# EAGLE design PlugEVSE_1x32A (EAGLE 8.6.0)
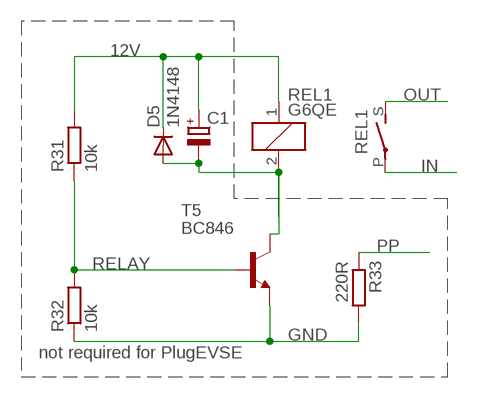
[diagram p0: schematic, sheet 1]

## Parts
C1  CPOL-EUSMCC  [SMC_C]
D5  1N4148  DIODE-SOD123  [SOD123]
R31  10k  R-EU_R0603  [R0603]
R32  10k  R-EU_R0603  [R0603]
R33  220R  R-EU_R2512  [R2512]
REL1  G6QE  [G6QE]
T5  BC846  [SOT23]

## Nets
12V: C1.+ D5.C R31.2 REL1.1
GND: R32.1 R33.2 T5.2(E)
IN: REL1.P
OUT: REL1.S
PP: R33.1
RELAY: R31.1 R32.2 T5.1(B)
RL: C1.- D5.A REL1.2 T5.3(C)

## Notes on the sheet
- not required for PlugEVSE

## Library data of the parts
C1 = rcl:CPOL-EU: POLARIZED CAPACITOR, European symbol; SPICEPREFIX: C
D5 = diode:DIODE-: DIODE
R31 R32 = rcl:R-EU_: RESISTOR, European symbol; SPICEPREFIX: R
R33 = rcl:R-EU_: RESISTOR, European symbol
REL1 = evse:G6QE
T5 = transistor:BC846: NPN TRANSISTOR

## Board
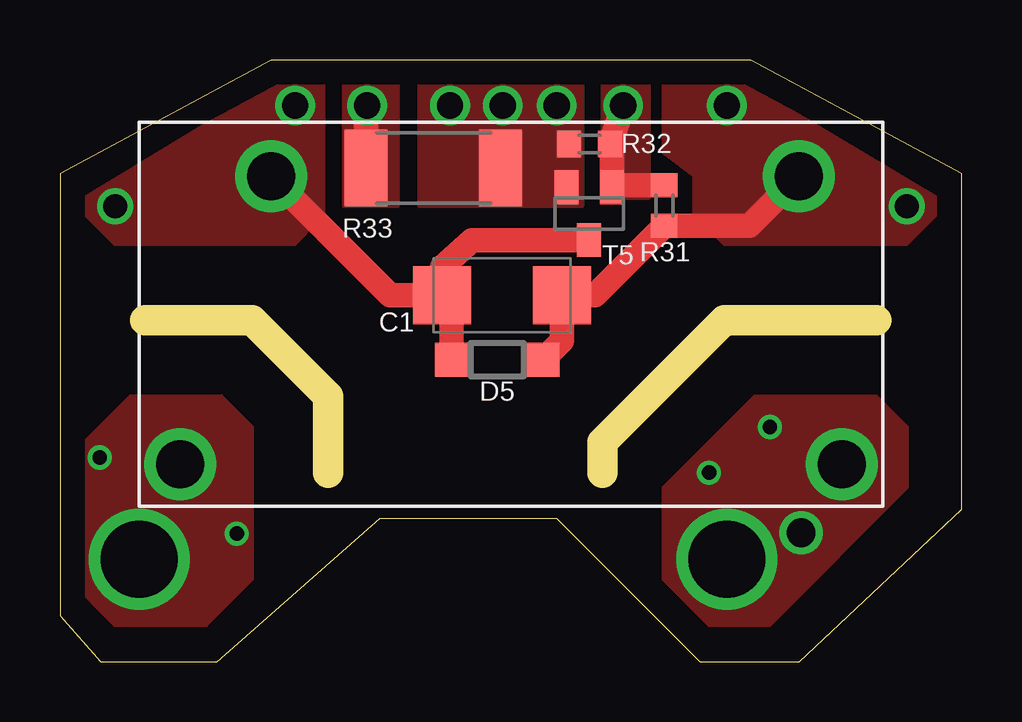
[diagram p1: board, top side]
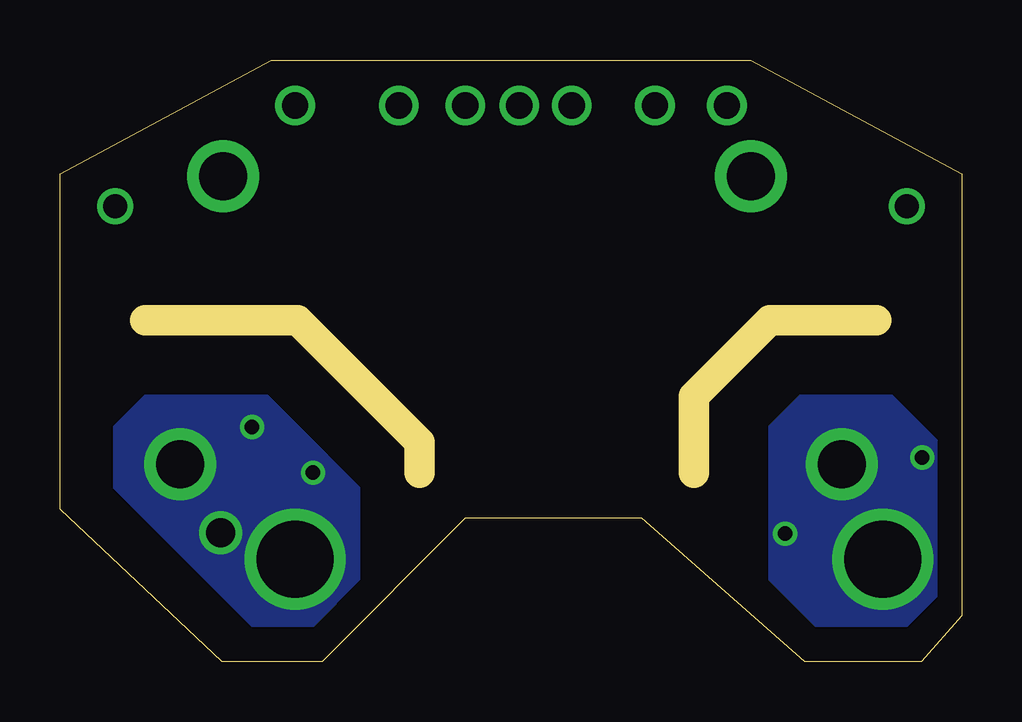
[diagram p2: board, bottom side, seen from below]

Size 37.6 x 25.07 mm. Coordinates in mm from the lower left corner, seen from the top.
Outline: 0,1.91 1.69,0 6.54,0 13.35,5.96 20.71,5.96 26.67,0 30.83,0 37.6,6.35 37.6,20.33 28.8,25.07 8.8,25.07 0,20.33 0,1.91
Copper layers (1*16): Top 0.035mm / dielectric 1.5mm / Bottom 0.035mm
Design rules "default": minimum track width 6mil, minimum drill 0.35mm, track to track 6mil, track to pad 6mil, pad to pad 6mil, via to via 6mil, smd to smd 6mil, copper to edge 40mil, drill to drill 6mil, minimum pad ring 10mil, minimum via ring 8mil, stop-mask expansion 4mil, vias tented up to drill 0mil, thermal gap 10mil
Milling: 6 lines

### Footprints (pad centres in the part's own frame; a part is rotated, then mirrored left to right if it is on the bottom)
SMC_C = smd 2.4 x 2.4: + -2.5,0; - 2.5,0
SOD123 = smd 1.4 x 1.4: A 1.9,0; C -1.9,0
R0603 = smd 1 x 1.1: 1 -0.85,0; 2 0.85,0
R2512 = smd 1.8 x 3.2: 1 -2.8,0; 2 2.8,0
G6QE = drill 2: 1 -12,-5.75; 2 10,-5.75; P -13.8,6.25; S 13.8,6.25
SOT23 = smd 1 x 1.4: 1 -0.95,-1.1; 2 0.95,-1.1; 3 0,1.1

### Placement (x,y rotation side)
C1  18.43,15.27 180 top
D5  18.23,12.57 180 top
R31  25.19,19 270 top
R32  22.07,21.56 0 top
R33  15.56,20.56 0 top
REL1  18.8,14.46 180 top
T5  22.06,18.66 180 top

### Tracks (layer width: path | path; a pad name or v marks a point on that pad's centre or on a via)
12V  (via drill 1, 1.1)
  Top 1.016: REL1.1 28.73,18.15 R31.2 22.3,15.27 C1.+ 20.93,13.38 D5.C
  other vias: 27.8,23.16 35.3,18.96
  pour Top: 28.33,24.21 25.15,24.21 25.15,21.2 26.42,20.23 26.42,18.66 27.69,17.39 35.31,17.39 36.58,18.66 36.58,19.3
GND  (via drill 1.1, 1.1 pad 1.3)
  other vias: 16.26,23.16 20.71,23.16 18.46,23.16
  pour Top (no thermals): 14.96,24.21 14.96,18.96 21.78,18.96 21.78,24.21
IN  (via drill 0.6, 1.2, 3.2)
  other vias: 27.8,4.26 30.9,5.37 27.05,7.87 29.59,9.78
  pour Top: 28.96,11.04 25.15,7.23 25.15,3.42 27.05,1.52 29.59,1.52 35.31,7.23 35.31,9.78 34.04,11.04
  pour Bottom: 34.04,11.04 35.31,9.78 35.31,7.23 29.59,1.52 27.05,1.52 25.15,3.42 25.15,7.23 28.96,11.04
OUT  (via drill 0.6, 3.2)
  other vias: 3.3,4.26 1.66,8.5 7.37,5.33
  pour Top: 6.74,11.04 8.01,9.78 8.01,3.42 6.1,1.52 2.29,1.52 0.39,3.42 0.39,8.5 2.93,11.04
  pour Bottom: 6.74,11.04 8.01,9.78 8.01,3.42 6.1,1.52 2.29,1.52 0.39,3.42 0.39,8.5 2.93,11.04
PP  (via drill 1.1)
  Top 1.016: v12.8,23.16 12.76,22.7 R33.1
  pour Top (no thermals): 11.82,24.21 11.82,18.96 14.09,18.96 14.09,24.21
RELAY  (via drill 1.1)
  Top 1.016: R31.1 23.04,19.85 T5.1 23.01,21.59 R32.2 23.48,23.13 v23.48,23.16
  pour Top (no thermals): 22.61,24.21 22.61,19.3 24.55,19.3 24.55,24.21
RL  (via drill 1, 1.1)
  Top 1.016: REL1.2 13.75,15.27 C1.- | D5.A 16.32,14.87 C1.- | T5.3 17.18,17.56 15.93,16.43 C1.-
  other vias: 9.8,23.16 2.3,18.96
  pour Top: 10.98,24.21 10.98,18.66 9.81,17.39 2.29,17.39 1.02,18.66 1.02,19.3 9.15,24.21